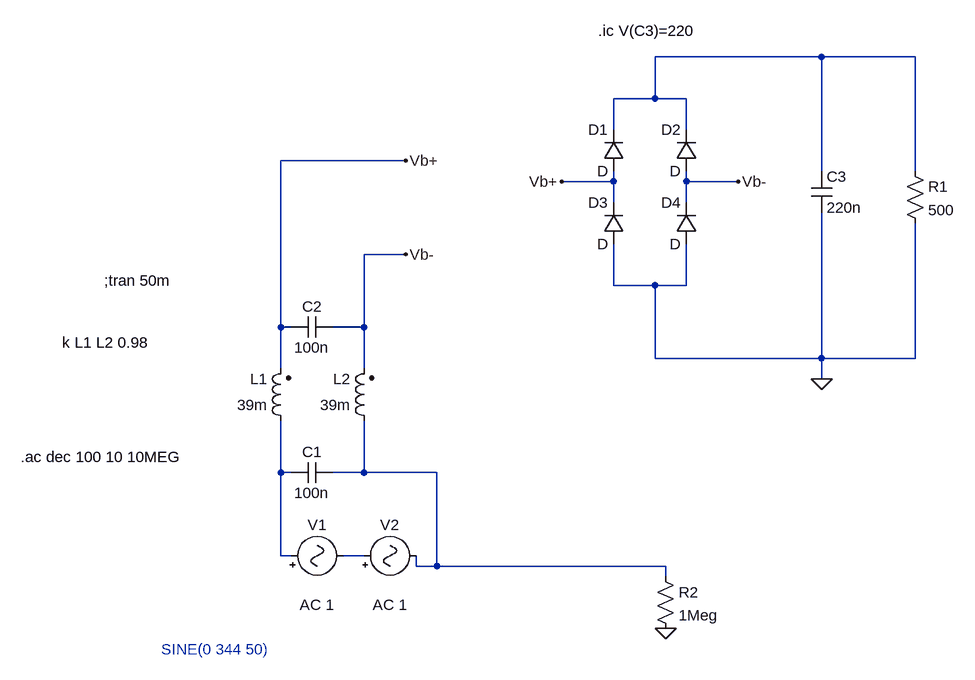
[diagram p0: schematic emi-filter-sim.asc]
emi-filter-sim.asc, the LTspice schematic file:
Version 4
SHEET 1 1108 680
WIRE 896 -368 640 -368
WIRE 1040 -368 896 -368
WIRE 640 -304 640 -368
WIRE 640 -304 576 -304
WIRE 688 -304 640 -304
WIRE 576 -256 576 -304
WIRE 688 -256 688 -304
WIRE 256 -208 64 -208
WIRE 896 -192 896 -368
WIRE 1040 -192 1040 -368
WIRE 576 -176 576 -192
WIRE 576 -176 496 -176
WIRE 688 -176 688 -192
WIRE 768 -176 688 -176
WIRE 576 -144 576 -176
WIRE 688 -144 688 -176
WIRE 256 -64 192 -64
WIRE 576 -16 576 -80
WIRE 640 -16 576 -16
WIRE 688 -16 688 -80
WIRE 688 -16 640 -16
WIRE 64 48 64 -208
WIRE 80 48 64 48
WIRE 192 48 192 -64
WIRE 192 48 144 48
WIRE 640 96 640 -16
WIRE 896 96 896 -128
WIRE 896 96 640 96
WIRE 1040 96 1040 -112
WIRE 1040 96 896 96
WIRE 64 112 64 48
WIRE 192 112 192 48
WIRE 896 128 896 96
WIRE 64 272 64 192
WIRE 80 272 64 272
WIRE 192 272 192 192
WIRE 192 272 144 272
WIRE 304 272 192 272
WIRE 64 400 64 272
WIRE 80 400 64 400
WIRE 192 400 160 400
WIRE 272 416 272 400
WIRE 304 416 304 272
WIRE 304 416 272 416
WIRE 656 416 304 416
WIRE 656 432 656 416
FLAG 256 -208 Vb+
FLAG 256 -64 Vb-
FLAG 496 -176 Vb+
FLAG 768 -176 Vb-
FLAG 896 128 0
FLAG 656 512 0
SYMBOL ind2 80 208 R180
WINDOW 0 36 80 Left 2
WINDOW 3 36 40 Left 2
SYMATTR InstName L1
SYMATTR Value 39m
SYMATTR Type ind
SYMBOL ind2 208 208 R180
WINDOW 0 36 80 Left 2
WINDOW 3 36 40 Left 2
SYMATTR InstName L2
SYMATTR Value 39m
SYMATTR Type ind
SYMBOL cap 144 256 R90
WINDOW 0 0 32 VBottom 2
WINDOW 3 32 32 VTop 2
SYMATTR InstName C1
SYMATTR Value 100n
SYMBOL cap 144 32 R90
WINDOW 0 0 32 VBottom 2
WINDOW 3 32 32 VTop 2
SYMATTR InstName C2
SYMATTR Value 100n
SYMBOL Misc\\signal 64 400 R270
WINDOW 0 32 56 VTop 2
WINDOW 3 -32 56 VBottom 2
WINDOW 123 -60 56 VBottom 2
WINDOW 39 0 0 Left 0
SYMATTR InstName V1
SYMATTR Value ""
SYMATTR Value2 AC 1
SYMBOL diode 592 -192 R180
WINDOW 0 24 64 Left 2
WINDOW 3 24 0 Left 2
SYMATTR InstName D1
SYMBOL diode 704 -192 R180
WINDOW 0 24 64 Left 2
WINDOW 3 24 0 Left 2
SYMATTR InstName D2
SYMBOL diode 592 -80 R180
WINDOW 0 24 64 Left 2
WINDOW 3 24 0 Left 2
SYMATTR InstName D3
SYMBOL diode 704 -80 R180
WINDOW 0 24 64 Left 2
WINDOW 3 24 0 Left 2
SYMATTR InstName D4
SYMBOL cap 880 -192 R0
SYMATTR InstName C3
SYMATTR Value 220n
SYMBOL res 1024 -208 R0
SYMATTR InstName R1
SYMATTR Value 500
SYMBOL res 640 416 R0
SYMATTR InstName R2
SYMATTR Value 1Meg
SYMBOL Misc\\signal 176 400 R270
WINDOW 0 32 56 VTop 2
WINDOW 3 -32 56 VBottom 2
WINDOW 123 -60 56 VBottom 2
WINDOW 39 0 0 Left 0
SYMATTR InstName V2
SYMATTR Value ""
SYMATTR Value2 AC 1
TEXT -272 72 Left 2 !k L1 L2 0.98
TEXT -208 -24 Left 2 !;tran 50m
TEXT 552 -408 Left 2 !.ic V(C3)=220
TEXT -120 544 Left 2 ;SINE(0 344 50)
TEXT -336 248 Left 2 !.ac dec 100 10 10MEG

The netlist it stands for:
* emi-filter-sim.asc
L1 N002 Vb+ 39m
L2 N003 Vb- 39m
C1 N003 N002 100n
C2 Vb- Vb+ 100n
V1 N002 N004 AC 1
D1 Vb+ N001 D
D2 Vb- N001 D
D3 0 Vb+ D
D4 0 Vb- D
C3 N001 0 220n
R1 N001 0 500
R2 N003 0 1Meg
V2 N004 N003 AC 1
.model D D
.lib standard.dio
k L1 L2 0.98
;tran 50m
.ic V(C3)=220
* SINE(0 344 50)
.ac dec 100 10 10MEG
.backanno
.end